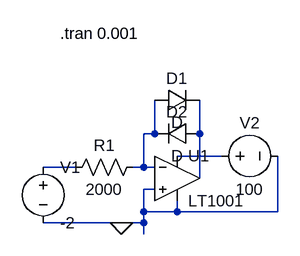
[diagram p0: schematic Draft46.asc]
Draft46.asc, the LTspice schematic file:
Version 4
SHEET 1 880 680
WIRE 304 256 304 208
WIRE 304 256 288 256
WIRE 368 256 368 208
WIRE 400 288 336 288
WIRE 192 304 144 304
WIRE 288 304 288 256
WIRE 288 304 272 304
WIRE 304 304 288 304
WIRE 368 320 368 256
WIRE 304 336 288 336
WIRE 288 368 288 336
WIRE 336 368 336 352
WIRE 336 368 288 368
WIRE 480 368 480 288
WIRE 480 368 336 368
WIRE 256 384 144 384
WIRE 288 384 288 368
WIRE 288 384 256 384
WIRE 288 400 288 384
FLAG 256 384 0
SYMBOL Opamps/LT1001 336 256 R0
SYMATTR InstName U1
SYMBOL diode 304 224 R270
WINDOW 0 32 32 VTop 2
WINDOW 3 0 32 VBottom 2
SYMATTR InstName D1
SYMBOL diode 368 240 R90
WINDOW 0 0 32 VBottom 2
WINDOW 3 32 32 VTop 2
SYMATTR InstName D2
SYMBOL res 288 288 R90
WINDOW 0 0 56 VBottom 2
WINDOW 3 32 56 VTop 2
SYMATTR InstName R1
SYMATTR Value 2000
SYMBOL voltage 144 288 R0
SYMATTR InstName V1
SYMATTR Value -2
SYMBOL voltage 384 288 R270
WINDOW 0 32 56 VTop 2
WINDOW 3 -32 56 VBottom 2
SYMATTR InstName V2
SYMATTR Value 100
TEXT 168 112 Left 2 !.tran 0.001

The netlist it stands for:
* Draft46.asc
XU1 0 N001 N003 0 N002 LT1001  ; pins In+ In- V+ V- OUT
D1 N001 N002 D
D2 N002 N001 D
R1 N001 N004 2000
V1 N004 0 -2
V2 N003 0 100
.model D D
.lib standard.dio
.tran 0.001
.lib LTC.lib
.backanno
.end